# EAGLE design frequency divider controller (EAGLE 6.4)
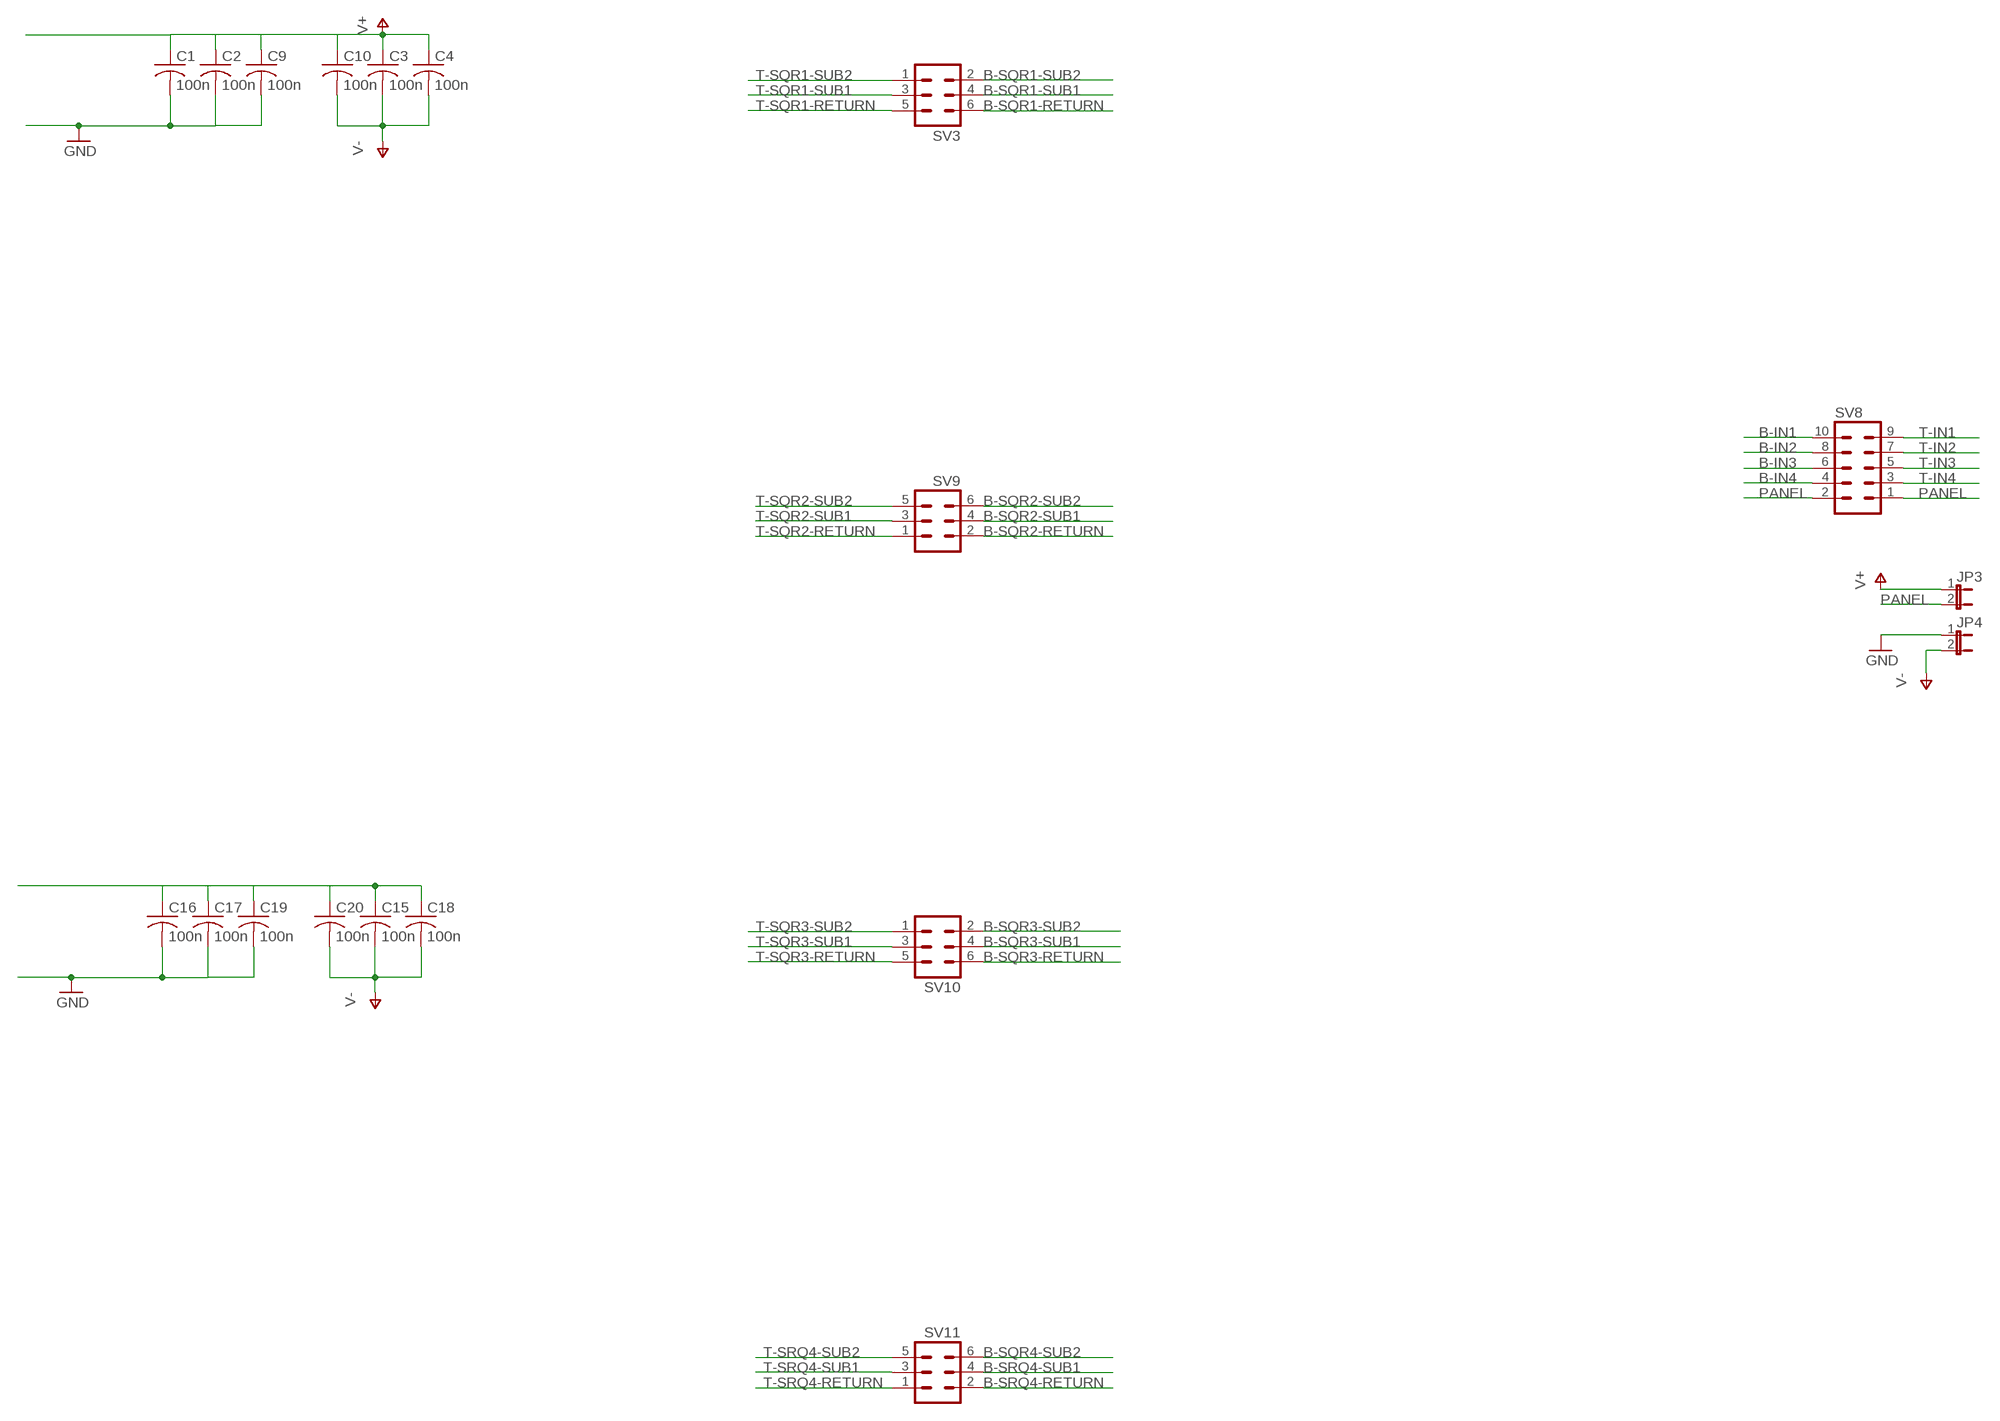
[diagram p0: schematic, sheet 1]

## Parts
C1  100n  C-US025-024X044  [C025-024X044]
C2  100n  C-US025-024X044  [C025-024X044]
C3  100n  C-US025-024X044  [C025-024X044]
C4  100n  C-US025-024X044  [C025-024X044]
C9  100n  C-US025-024X044  [C025-024X044]
C10  100n  C-US025-024X044  [C025-024X044]
C15  100n  C-US025-024X044  [C025-024X044]
C16  100n  C-US025-024X044  [C025-024X044]
C17  100n  C-US025-024X044  [C025-024X044]
C18  100n  C-US025-024X044  [C025-024X044]
C19  100n  C-US025-024X044  [C025-024X044]
C20  100n  C-US025-024X044  [C025-024X044]
JP3  JP1E  [JP1]
JP4  JP1E  [JP1]
SV3  MA03-2  [MA03-2]
SV8  MA05-2  [MA05-2]
SV9  MA03-2  [MA03-2]
SV10  MA03-2  [MA03-2]
SV11  MA03-2  [MA03-2]

## Nets
B-IN1: SV8.10
B-IN2: SV8.8
B-IN3: SV8.6
B-IN4: SV8.4
B-SQR1-RETURN: SV3.6
B-SQR1-SUB1: SV3.4
B-SQR1-SUB2: SV3.2
B-SQR2-RETURN: SV9.2
B-SQR2-SUB1: SV9.4
B-SQR2-SUB2: SV9.6
B-SQR3-RETURN: SV10.6
B-SQR3-SUB1: SV10.4
B-SQR3-SUB2: SV10.2
B-SQR4-SUB2: SV11.6
B-SRQ4-RETURN: SV11.2
B-SRQ4-SUB1: SV11.4
GND: C1.2 C2.2 C9.2 C16.2 C17.2 C19.2 JP4.1
N$2: C15.1 C16.1 C17.1 C18.1 C19.1 C20.1
PANEL: JP3.2 SV8.1 SV8.2
T-IN1: SV8.9
T-IN2: SV8.7
T-IN3: SV8.5
T-IN4: SV8.3
T-SQR1-RETURN: SV3.5
T-SQR1-SUB1: SV3.3
T-SQR1-SUB2: SV3.1
T-SQR2-RETURN: SV9.1
T-SQR2-SUB1: SV9.3
T-SQR2-SUB2: SV9.5
T-SQR3-RETURN: SV10.5
T-SQR3-SUB1: SV10.3
T-SQR3-SUB2: SV10.1
T-SRQ4-RETURN: SV11.1
T-SRQ4-SUB1: SV11.3
T-SRQ4-SUB2: SV11.5
V+: C1.1 C2.1 C3.1 C4.1 C9.1 C10.1 JP3.1
V-: C3.2 C4.2 C10.2 C15.2 C18.2 C20.2 JP4.2

## Library data of the parts
C1-C4 C9 C10 C15-C20 = resistor:C-US: CAPACITOR, American symbol
JP3 JP4 = jumper:JP1E: JUMPER
SV3 SV9-SV11 = joakim:MA03-2: PIN HEADER; OC_FARNELL: unknown; OC_NEWARK: unknown
SV8 = joakim:MA05-2: PIN HEADER; OC_FARNELL: unknown; OC_NEWARK: unknown

## Board
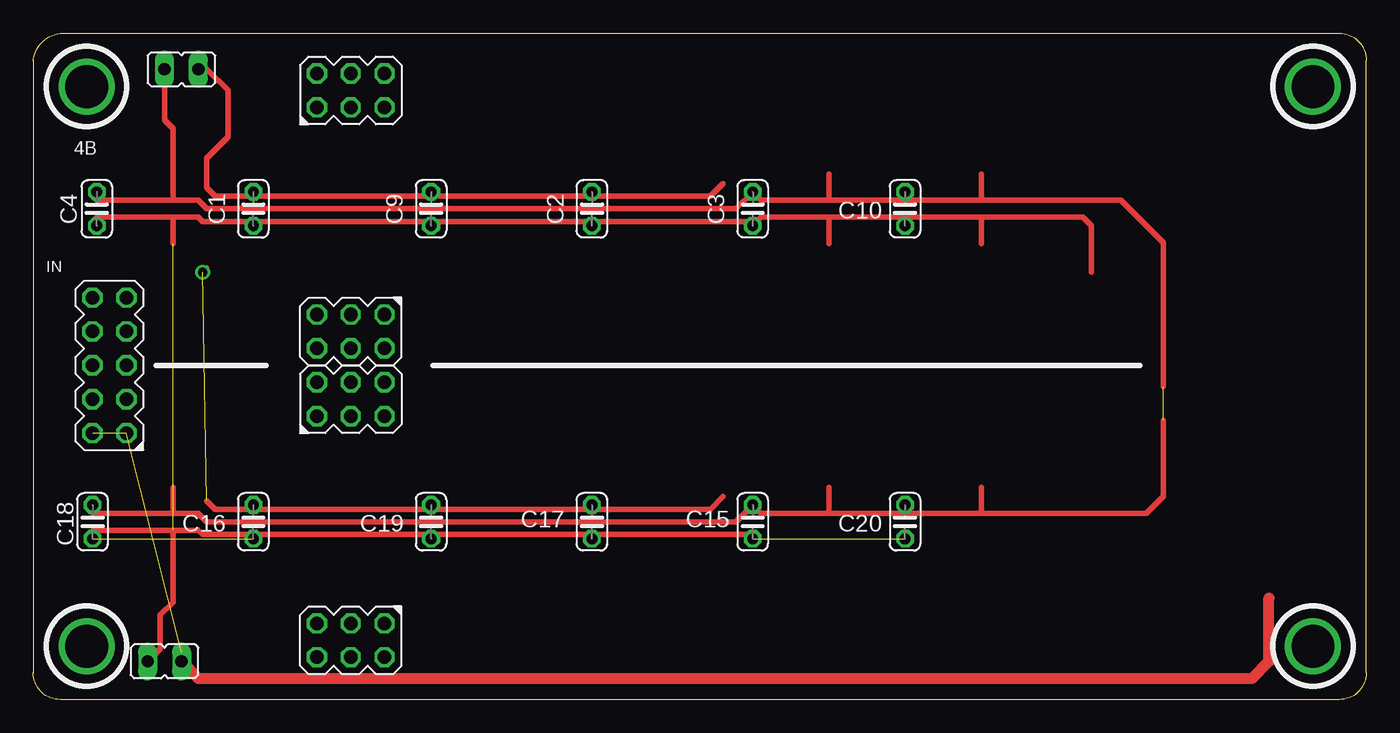
[diagram p1: board, top side]
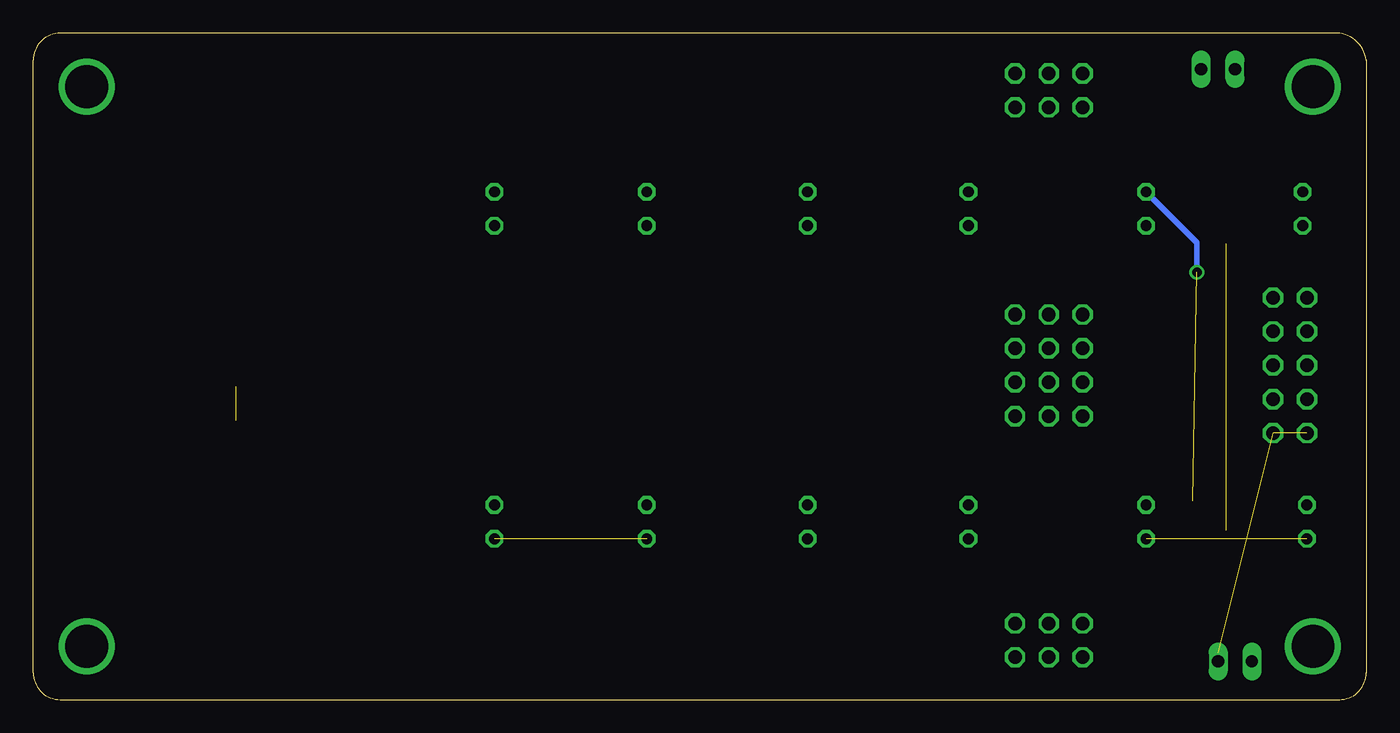
[diagram p2: board, bottom side, seen from below]

Size 100 x 50 mm. Coordinates in mm from the lower left corner, seen from the top.
Outline: 100,2 100,48 arc90 98,50 2,50 arc76 0,48 0,2 arc90 2,0 98,0 arc90 100,2
Copper layers (1*16): Top 0.035mm / dielectric 1.5mm / Bottom 0.035mm
Design rules "default": minimum track width 10mil, minimum drill 24mil, track to track 8mil, track to pad 8mil, pad to pad 8mil, via to via 8mil, smd to smd 8mil, copper to edge 40mil, drill to drill 8mil, minimum pad ring 10mil, minimum via ring 8mil, stop-mask expansion 4mil, vias tented up to drill 0mil, thermal gap 10mil

### Footprints (pad centres in the part's own frame; a part is rotated, then mirrored left to right if it is on the bottom)
C025-024X044 = drill 0.813 octagon: 1 -1.27,0; 2 1.27,0
JP1 = drill 0.914 long: 1 0,-1.27; 2 0,1.27
MA03-2 = drill 1.016 octagon: 1 -2.54,-1.27; 2 -2.54,1.27; 3 0,-1.27; 4 0,1.27; 5 2.54,-1.27; 6 2.54,1.27
MA05-2 = drill 1.016 octagon: 1 -5.08,-1.27; 2 -5.08,1.27; 3 -2.54,-1.27; 4 -2.54,1.27; 5 0,-1.27; 6 0,1.27; 7 2.54,-1.27; 8 2.54,1.27; 9 5.08,-1.27; 10 5.08,1.27

### Placement (x,y rotation side)
C1  16.51,36.83 90 top
C2  41.91,36.83 90 top
C3  53.98,36.83 90 top
C4  4.76,36.83 90 top
C9  29.84,36.83 90 top
C10  65.41,36.83 90 top
C15  53.98,13.34 90 top
C16  16.51,13.34 90 top
C17  41.91,13.34 90 top
C18  4.45,13.34 90 top
C19  29.84,13.34 90 top
C20  65.41,13.34 90 top
JP3  9.84,2.86 270 top
JP4  11.11,47.31 90 top
SV3  23.81,45.72 0 top
SV8  5.71,25.08 90 top
SV9  23.81,27.62 180 top
SV10  23.81,22.54 0 top
SV11  23.81,4.45 180 top

### Tracks (layer width: path | path; a pad name or v marks a point on that pad's centre or on a via)
GND  (via drill 0.7)  (1 unrouted)
  Top 0.406: 51.75,38.73 50.8,37.78 42.23,37.78 C2.2 41.59,37.78 30.48,37.78 30.16,38.1 C9.2 29.53,37.78 16.83,37.78 C1.2 16.19,37.78 13.65,37.78 13.02,38.42 13.02,40.64 14.61,42.23 14.61,45.72 13.02,47.31 JP4.1 | 51.75,15.24 50.8,14.29 42.23,14.29 C17.2 41.59,14.29 30.16,14.29 C19.2 29.53,14.29 16.83,14.29 C16.2 16.19,14.29 13.65,14.29 13.02,14.92 | 13.02,32.38 v12.7,32.07
  Bottom 0.406: v12.7,32.07 12.7,34.29 C1.2
N$2  (2 unrouted)
  Top 0.406: C15.1 53.66,12.38 42.23,12.38 C17.1 41.59,12.38 30.16,12.38 C19.1 29.53,12.38 16.83,12.38 C16.1
N$27  (via drill 3.2)
  other vias: 4,46
N$28  (via drill 3.2)
  other vias: 96,46
N$29  (via drill 3.2)
  other vias: 96,4
N$30  (via drill 3.2)
  other vias: 4,4
PANEL  (2 unrouted)
  Top 0.813: JP3.2 12.38,1.59 91.44,1.59 92.71,2.86 92.71,7.62
  Bottom 0.813: 11.11,3.49 JP3.2
V+  (1 unrouted)
  Top 0.406: 10.48,34.23 10.48,36.2 | 10.48,36.2 12.38,36.2 12.7,35.88 16.51,35.88 | C1.1 16.51,35.88 | C4.1 4.76,36.2 10.48,36.2 | 16.51,35.88 29.53,35.88 C9.1 29.84,35.88 41.59,35.88 C2.1 42.23,35.88 53.66,35.88 C3.1 54.61,36.2 59.69,36.2 | 59.69,36.2 65.41,36.2 | C10.1 65.41,36.2 | 65.41,36.2 71.12,36.2 | 71.12,36.2 78.74,36.2 79.38,35.56 79.38,32.07 | 71.12,34.23 71.12,36.2 | 59.69,34.23 59.69,36.2 | 16.19,12.38 12.7,12.38 12.38,12.7 10.48,12.7 | 10.48,12.7 4.45,12.7 | JP3.1 9.53,3.81 9.53,6.35 10.48,7.3 10.48,12.7
V-  (1 unrouted)
  Top 0.406: C4.2 4.76,37.47 10.48,37.47 | 10.48,37.47 10.48,39.43 10.48,42.86 9.84,43.5 JP4.2 | 10.48,37.47 12.38,37.47 13.02,36.83 52.7,36.83 C3.2 54.61,37.47 59.69,37.47 | 59.69,37.47 59.69,39.43 | 65.41,37.47 59.69,37.47 | C10.2 65.41,37.47 | 65.41,37.47 71.12,37.47 | 71.12,39.43 71.12,37.47 | 71.12,37.47 81.6,37.47 84.77,34.29 84.77,23.5 | 65.41,13.97 59.69,13.97 | 59.69,13.97 54.61,13.97 C15.2 52.7,13.34 13.02,13.34 12.38,13.97 10.48,13.97 | C20.2 65.41,13.97 | 65.41,13.97 71.12,13.97 | 71.12,13.97 83.5,13.97 84.77,15.24 84.77,20.95 | C18.2 4.45,13.97 10.48,13.97 | 10.48,15.94 10.48,13.97 | 59.69,15.94 59.69,13.97 | 71.12,15.94 71.12,13.97

### Text on the board
tNames: 4B | IN